# EAGLE design esp12extension (EAGLE 7.7.0)
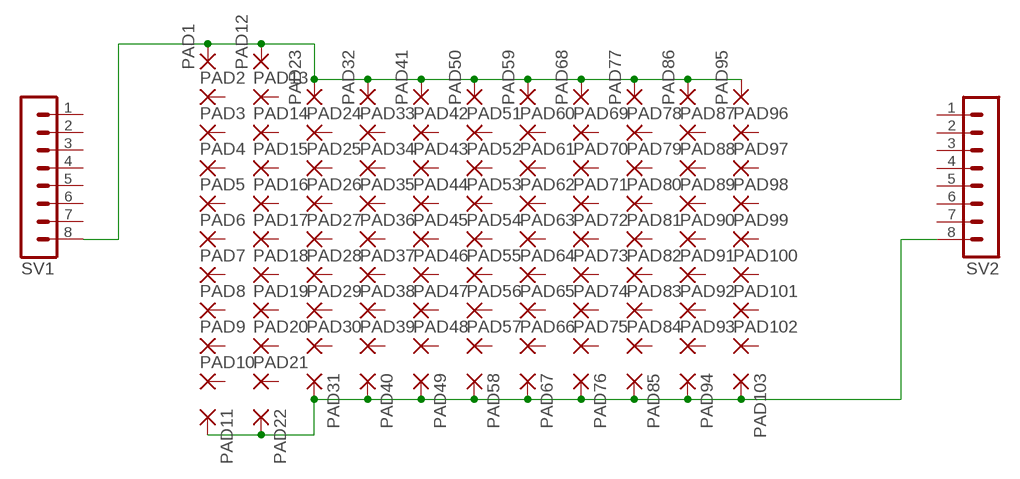
[diagram p0: schematic, sheet 1]

## Parts
PAD1  1,6/0,8  [1,6/0,8]
PAD2  1,6/0,8  [1,6/0,8]
PAD3  1,6/0,8  [1,6/0,8]
PAD4  1,6/0,8  [1,6/0,8]
PAD5  1,6/0,8  [1,6/0,8]
PAD6  1,6/0,8  [1,6/0,8]
PAD7  1,6/0,8  [1,6/0,8]
PAD8  1,6/0,8  [1,6/0,8]
PAD9  1,6/0,8  [1,6/0,8]
PAD10  1,6/0,8  [1,6/0,8]
PAD11  1,6/0,8  [1,6/0,8]
PAD12  1,6/0,8  [1,6/0,8]
PAD13  1,6/0,8  [1,6/0,8]
PAD14  1,6/0,8  [1,6/0,8]
PAD15  1,6/0,8  [1,6/0,8]
PAD16  1,6/0,8  [1,6/0,8]
PAD17  1,6/0,8  [1,6/0,8]
PAD18  1,6/0,8  [1,6/0,8]
PAD19  1,6/0,8  [1,6/0,8]
PAD20  1,6/0,8  [1,6/0,8]
PAD21  1,6/0,8  [1,6/0,8]
PAD22  1,6/0,8  [1,6/0,8]
PAD23  1,6/0,8  [1,6/0,8]
PAD24  1,6/0,8  [1,6/0,8]
PAD25  1,6/0,8  [1,6/0,8]
PAD26  1,6/0,8  [1,6/0,8]
PAD27  1,6/0,8  [1,6/0,8]
PAD28  1,6/0,8  [1,6/0,8]
PAD29  1,6/0,8  [1,6/0,8]
PAD30  1,6/0,8  [1,6/0,8]
PAD31  1,6/0,8  [1,6/0,8]
PAD32  1,6/0,8  [1,6/0,8]
PAD33  1,6/0,8  [1,6/0,8]
PAD34  1,6/0,8  [1,6/0,8]
PAD35  1,6/0,8  [1,6/0,8]
PAD36  1,6/0,8  [1,6/0,8]
PAD37  1,6/0,8  [1,6/0,8]
PAD38  1,6/0,8  [1,6/0,8]
PAD39  1,6/0,8  [1,6/0,8]
PAD40  1,6/0,8  [1,6/0,8]
PAD41  1,6/0,8  [1,6/0,8]
PAD42  1,6/0,8  [1,6/0,8]
PAD43  1,6/0,8  [1,6/0,8]
PAD44  1,6/0,8  [1,6/0,8]
PAD45  1,6/0,8  [1,6/0,8]
PAD46  1,6/0,8  [1,6/0,8]
PAD47  1,6/0,8  [1,6/0,8]
PAD48  1,6/0,8  [1,6/0,8]
PAD49  1,6/0,8  [1,6/0,8]
PAD50  1,6/0,8  [1,6/0,8]
PAD51  1,6/0,8  [1,6/0,8]
PAD52  1,6/0,8  [1,6/0,8]
PAD53  1,6/0,8  [1,6/0,8]
PAD54  1,6/0,8  [1,6/0,8]
PAD55  1,6/0,8  [1,6/0,8]
PAD56  1,6/0,8  [1,6/0,8]
PAD57  1,6/0,8  [1,6/0,8]
PAD58  1,6/0,8  [1,6/0,8]
PAD59  1,6/0,8  [1,6/0,8]
PAD60  1,6/0,8  [1,6/0,8]
PAD61  1,6/0,8  [1,6/0,8]
PAD62  1,6/0,8  [1,6/0,8]
PAD63  1,6/0,8  [1,6/0,8]
PAD64  1,6/0,8  [1,6/0,8]
PAD65  1,6/0,8  [1,6/0,8]
PAD66  1,6/0,8  [1,6/0,8]
PAD67  1,6/0,8  [1,6/0,8]
PAD68  1,6/0,8  [1,6/0,8]
PAD69  1,6/0,8  [1,6/0,8]
PAD70  1,6/0,8  [1,6/0,8]
PAD71  1,6/0,8  [1,6/0,8]
PAD72  1,6/0,8  [1,6/0,8]
PAD73  1,6/0,8  [1,6/0,8]
PAD74  1,6/0,8  [1,6/0,8]
PAD75  1,6/0,8  [1,6/0,8]
PAD76  1,6/0,8  [1,6/0,8]
PAD77  1,6/0,8  [1,6/0,8]
PAD78  1,6/0,8  [1,6/0,8]
PAD79  1,6/0,8  [1,6/0,8]
PAD80  1,6/0,8  [1,6/0,8]
PAD81  1,6/0,8  [1,6/0,8]
PAD82  1,6/0,8  [1,6/0,8]
PAD83  1,6/0,8  [1,6/0,8]
PAD84  1,6/0,8  [1,6/0,8]
PAD85  1,6/0,8  [1,6/0,8]
PAD86  1,6/0,8  [1,6/0,8]
PAD87  1,6/0,8  [1,6/0,8]
PAD88  1,6/0,8  [1,6/0,8]
PAD89  1,6/0,8  [1,6/0,8]
PAD90  1,6/0,8  [1,6/0,8]
PAD91  1,6/0,8  [1,6/0,8]
PAD92  1,6/0,8  [1,6/0,8]
PAD93  1,6/0,8  [1,6/0,8]
PAD94  1,6/0,8  [1,6/0,8]
PAD95  1,6/0,8  [1,6/0,8]
PAD96  1,6/0,8  [1,6/0,8]
PAD97  1,6/0,8  [1,6/0,8]
PAD98  1,6/0,8  [1,6/0,8]
PAD99  1,6/0,8  [1,6/0,8]
PAD100  1,6/0,8  [1,6/0,8]
PAD101  1,6/0,8  [1,6/0,8]
PAD102  1,6/0,8  [1,6/0,8]
PAD103  1,6/0,8  [1,6/0,8]
SV1  MA08-1  [MA08-1]
SV2  MA08-1  [MA08-1]

## Nets
GND: PAD11.1(P) PAD22.1(P) PAD31.1(P) PAD40.1(P) PAD49.1(P) PAD58.1(P) PAD67.1(P) PAD76.1(P) PAD85.1(P) PAD94.1(P) PAD103.1(P) SV2.8
VCC: PAD1.1(P) PAD12.1(P) PAD23.1(P) PAD32.1(P) PAD41.1(P) PAD50.1(P) PAD59.1(P) PAD68.1(P) PAD77.1(P) PAD86.1(P) PAD95.1(P) SV1.8
Unconnected: PAD2.1(P) PAD3.1(P) PAD4.1(P) PAD5.1(P) PAD6.1(P) PAD7.1(P) PAD8.1(P) PAD9.1(P) PAD10.1(P) PAD13.1(P) PAD14.1(P) PAD15.1(P) PAD16.1(P) PAD17.1(P) PAD18.1(P) PAD19.1(P) PAD20.1(P) PAD21.1(P) PAD24.1(P) PAD25.1(P) PAD26.1(P) PAD27.1(P) PAD28.1(P) PAD29.1(P) PAD30.1(P) PAD33.1(P) PAD34.1(P) PAD35.1(P) PAD36.1(P) PAD37.1(P) PAD38.1(P) PAD39.1(P) PAD42.1(P) PAD43.1(P) PAD44.1(P) PAD45.1(P) PAD46.1(P) PAD47.1(P) PAD48.1(P) PAD51.1(P) PAD52.1(P) PAD53.1(P) PAD54.1(P) PAD55.1(P) PAD56.1(P) PAD57.1(P) PAD60.1(P) PAD61.1(P) PAD62.1(P) PAD63.1(P) PAD64.1(P) PAD65.1(P) PAD66.1(P) PAD69.1(P) PAD70.1(P) PAD71.1(P) PAD72.1(P) PAD73.1(P) PAD74.1(P) PAD75.1(P) PAD78.1(P) PAD79.1(P) PAD80.1(P) PAD81.1(P) PAD82.1(P) PAD83.1(P) PAD84.1(P) PAD87.1(P) PAD88.1(P) PAD89.1(P) PAD90.1(P) PAD91.1(P) PAD92.1(P) PAD93.1(P) PAD96.1(P) PAD97.1(P) PAD98.1(P) PAD99.1(P) PAD100.1(P) PAD101.1(P) PAD102.1(P) SV1.1 SV1.2 SV1.3 SV1.4 SV1.5 SV1.6 SV1.7 SV2.1 SV2.2 SV2.3 SV2.4 SV2.5 SV2.6 SV2.7

## Library data of the parts
PAD1-PAD103 = wirepad:1,6/0,8: THROUGH-HOLE PAD
SV1 SV2 = con-lstb:MA08-1: PIN HEADER; OC_FARNELL: unknown; OC_NEWARK: unknown

## Board
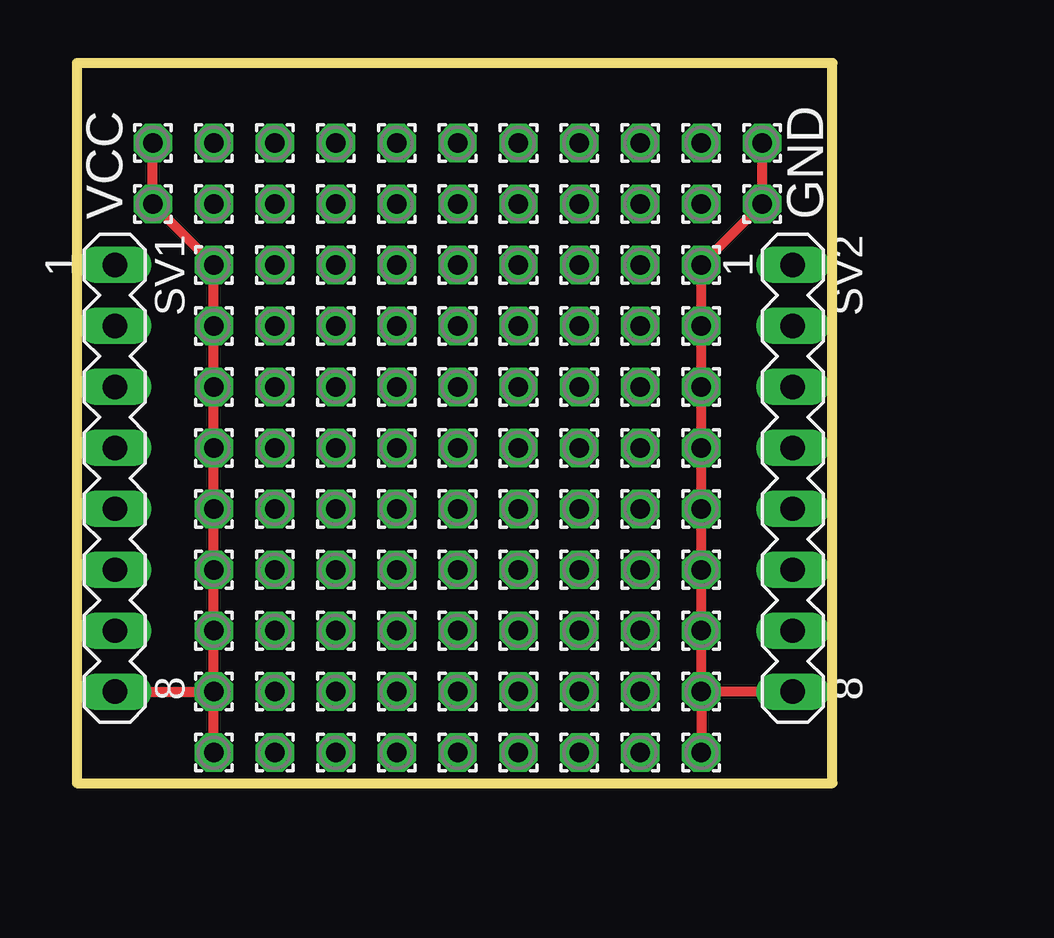
[diagram p1: board, top side]
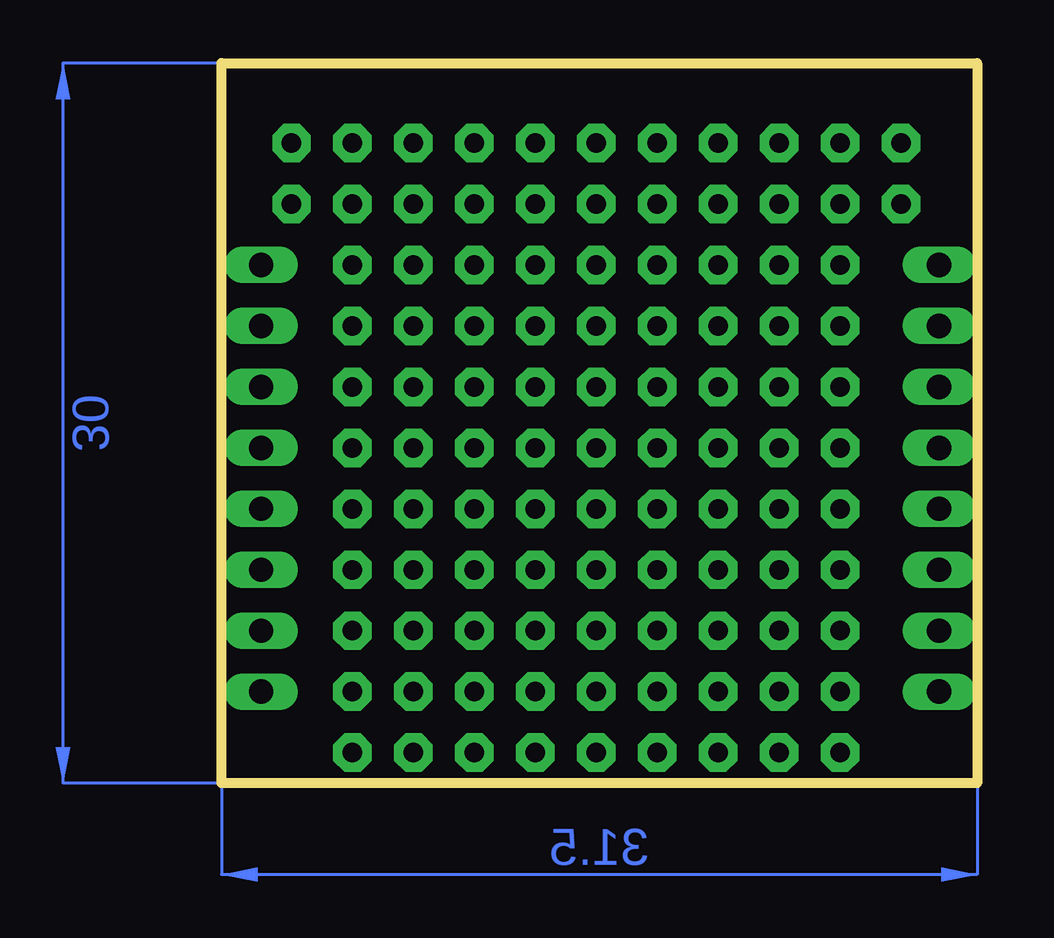
[diagram p2: board, bottom side, seen from below]

Size 31.5 x 30 mm. Coordinates in mm from the lower left corner, seen from the top.
Outline: 0,0 31.5,0 31.5,30 0,30 0,0
Copper layers (1*16): Top 0.035mm / dielectric 1.5mm / Bottom 0.035mm
Design rules "default": minimum track width 10mil, minimum drill 24mil, track to track 8mil, track to pad 8mil, pad to pad 8mil, via to via 8mil, smd to smd 8mil, copper to edge 40mil, drill to drill 8mil, minimum pad ring 10mil, minimum via ring 8mil, stop-mask expansion 4mil, vias tented up to drill 0mil, thermal gap 10mil

### Footprints (pad centres in the part's own frame; a part is rotated, then mirrored left to right if it is on the bottom)
1,6/0,8 = drill 0.813 pad 1.6 octagon: 1 0,0
MA08-1 = drill 1.016 long: 1 -8.89,0; 2 -6.35,0; 3 -3.81,0; 4 -1.27,0; 5 1.27,0; 6 3.81,0; 7 6.35,0; 8 8.89,0

### Placement (x,y rotation side)
PAD1  3.17,26.67 0 top
PAD2  5.71,26.67 0 top
PAD3  8.26,26.67 0 top
PAD4  10.79,26.67 0 top
PAD5  13.34,26.67 0 top
PAD6  15.88,26.67 0 top
PAD7  18.41,26.67 0 top
PAD8  20.95,26.67 0 top
PAD9  23.5,26.67 0 top
PAD10  26.04,26.67 0 top
PAD11  28.57,26.67 0 top
PAD12  3.17,24.13 0 top
PAD13  5.71,24.13 0 top
PAD14  8.26,24.13 0 top
PAD15  10.79,24.13 0 top
PAD16  13.34,24.13 0 top
PAD17  15.88,24.13 0 top
PAD18  18.41,24.13 0 top
PAD19  20.95,24.13 0 top
PAD20  23.5,24.13 0 top
PAD21  26.04,24.13 0 top
PAD22  28.57,24.13 0 top
PAD23  5.71,21.59 0 top
PAD24  8.26,21.59 0 top
PAD25  10.79,21.59 0 top
PAD26  13.34,21.59 0 top
PAD27  18.41,21.59 0 top
PAD28  20.95,21.59 0 top
PAD29  15.88,21.59 0 top
PAD30  23.5,21.59 0 top
PAD31  26.04,21.59 0 top
PAD32  5.71,19.05 0 top
PAD33  8.26,19.05 0 top
PAD34  10.79,19.05 0 top
PAD35  13.34,19.05 0 top
PAD36  15.88,19.05 0 top
PAD37  18.41,19.05 0 top
PAD38  20.95,19.05 0 top
PAD39  23.5,19.05 0 top
PAD40  26.04,19.05 0 top
PAD41  5.71,16.51 0 top
PAD42  10.79,16.51 0 top
PAD43  13.34,16.51 0 top
PAD44  15.88,16.51 0 top
PAD45  8.26,16.51 0 top
PAD46  18.41,16.51 0 top
PAD47  20.95,16.51 0 top
PAD48  23.5,16.51 0 top
PAD49  26.04,16.51 0 top
PAD50  5.71,13.97 0 top
PAD51  8.26,13.97 0 top
PAD52  10.79,13.97 0 top
PAD53  13.34,13.97 0 top
PAD54  15.88,13.97 0 top
PAD55  18.41,13.97 0 top
PAD56  20.95,13.97 0 top
PAD57  23.5,13.97 0 top
PAD58  26.04,13.97 0 top
PAD59  5.71,11.43 0 top
PAD60  8.26,11.43 0 top
PAD61  10.79,11.43 0 top
PAD62  13.34,11.43 0 top
PAD63  15.88,11.43 0 top
PAD64  18.41,11.43 0 top
PAD65  20.95,11.43 0 top
PAD66  23.5,11.43 0 top
PAD67  26.04,11.43 0 top
PAD68  5.71,8.89 0 top
PAD69  8.26,8.89 0 top
PAD70  10.79,8.89 0 top
PAD71  13.34,8.89 0 top
PAD72  15.88,8.89 0 top
PAD73  18.41,8.89 0 top
PAD74  20.95,8.89 0 top
PAD75  23.5,8.89 0 top
PAD76  26.04,8.89 0 top
PAD77  5.71,6.35 0 top
PAD78  8.26,6.35 0 top
PAD79  10.79,6.35 0 top
PAD80  13.34,6.35 0 top
PAD81  15.88,6.35 0 top
PAD82  18.41,6.35 0 top
PAD83  20.95,6.35 0 top
PAD84  23.5,6.35 0 top
PAD85  26.04,6.35 0 top
PAD86  5.71,3.81 0 top
PAD87  8.26,3.81 0 top
PAD88  10.79,3.81 0 top
PAD89  13.34,3.81 0 top
PAD90  15.88,3.81 0 top
PAD91  18.41,3.81 0 top
PAD92  20.95,3.81 0 top
PAD93  23.5,3.81 0 top
PAD94  26.04,3.81 0 top
PAD95  5.71,1.27 0 top
PAD96  8.26,1.27 0 top
PAD97  10.79,1.27 0 top
PAD98  13.34,1.27 0 top
PAD99  15.88,1.27 0 top
PAD100  18.41,1.27 0 top
PAD101  20.95,1.27 0 top
PAD102  23.5,1.27 0 top
PAD103  26.04,1.27 0 top
SV1  1.59,12.7 270 top
SV2  29.84,12.7 270 top

### Tracks (layer width: path | path; a pad name or v marks a point on that pad's centre or on a via)
GND
  Top 0.406: PAD94.1 PAD85.1 PAD76.1 PAD67.1 PAD58.1 PAD49.1 PAD40.1 PAD31.1 PAD22.1 PAD11.1 | PAD94.1 PAD103.1 | SV2.8 PAD94.1
VCC
  Top 0.406: PAD86.1 PAD77.1 PAD68.1 PAD59.1 PAD50.1 PAD41.1 PAD32.1 PAD23.1 PAD12.1 PAD1.1 | PAD95.1 PAD86.1 | SV1.8 PAD86.1
(copper drawn outside any net)
  shapes: Bottom area x2

### Text on the board
tNames: VCC | GND